# Altium schematic sheet TIDA-01349_MCU_Supply_PWM_Temp.SchDoc: MCUInterface_PowerSupply_PWM_Temperature
size 431 x 279 mm; Date: Not shown in title block; ApprovedBy: Not shown in title block; CheckedBy: Not shown in title block; Author: Not shown in title block; CompanyName: Not shown in title block; Engineer: Not shown in title block; Organization: Not shown in title block; Address1: Not shown in title block; Address2: Not shown in title block; Address3: Not shown in title block; Address4: Not shown in title block; DocumentNumber: 1; Revision: Use project parameter SCH_Rev; SheetNumber: 2; SheetTotal: 4; PageSetup: Record=PageOptions|CenterHorizontal=True|CenterVertical=True|PrintScale=1.00|XCorrection=1.00|YCorrection=1.00|PrintKind=0|BorderSize=5000000|LeftOffset=0|BottomOffset=0|Orientation=2|PaperLength=1000|PaperWidth=1000|Scale=100|PaperSource=15|PrintQuality=600|MediaType=1|DitherType=10|PaperKind=Letter|PrintScaleMode=1; CurrentTime: Not shown in title block; CurrentDate: Not shown in title block; Time: Not shown in title block; DocumentFullPathAndName: Not shown in title block; DocumentName: Not shown in title block; ModifiedDate: Not shown in title block; ImagePath: Not shown in title block
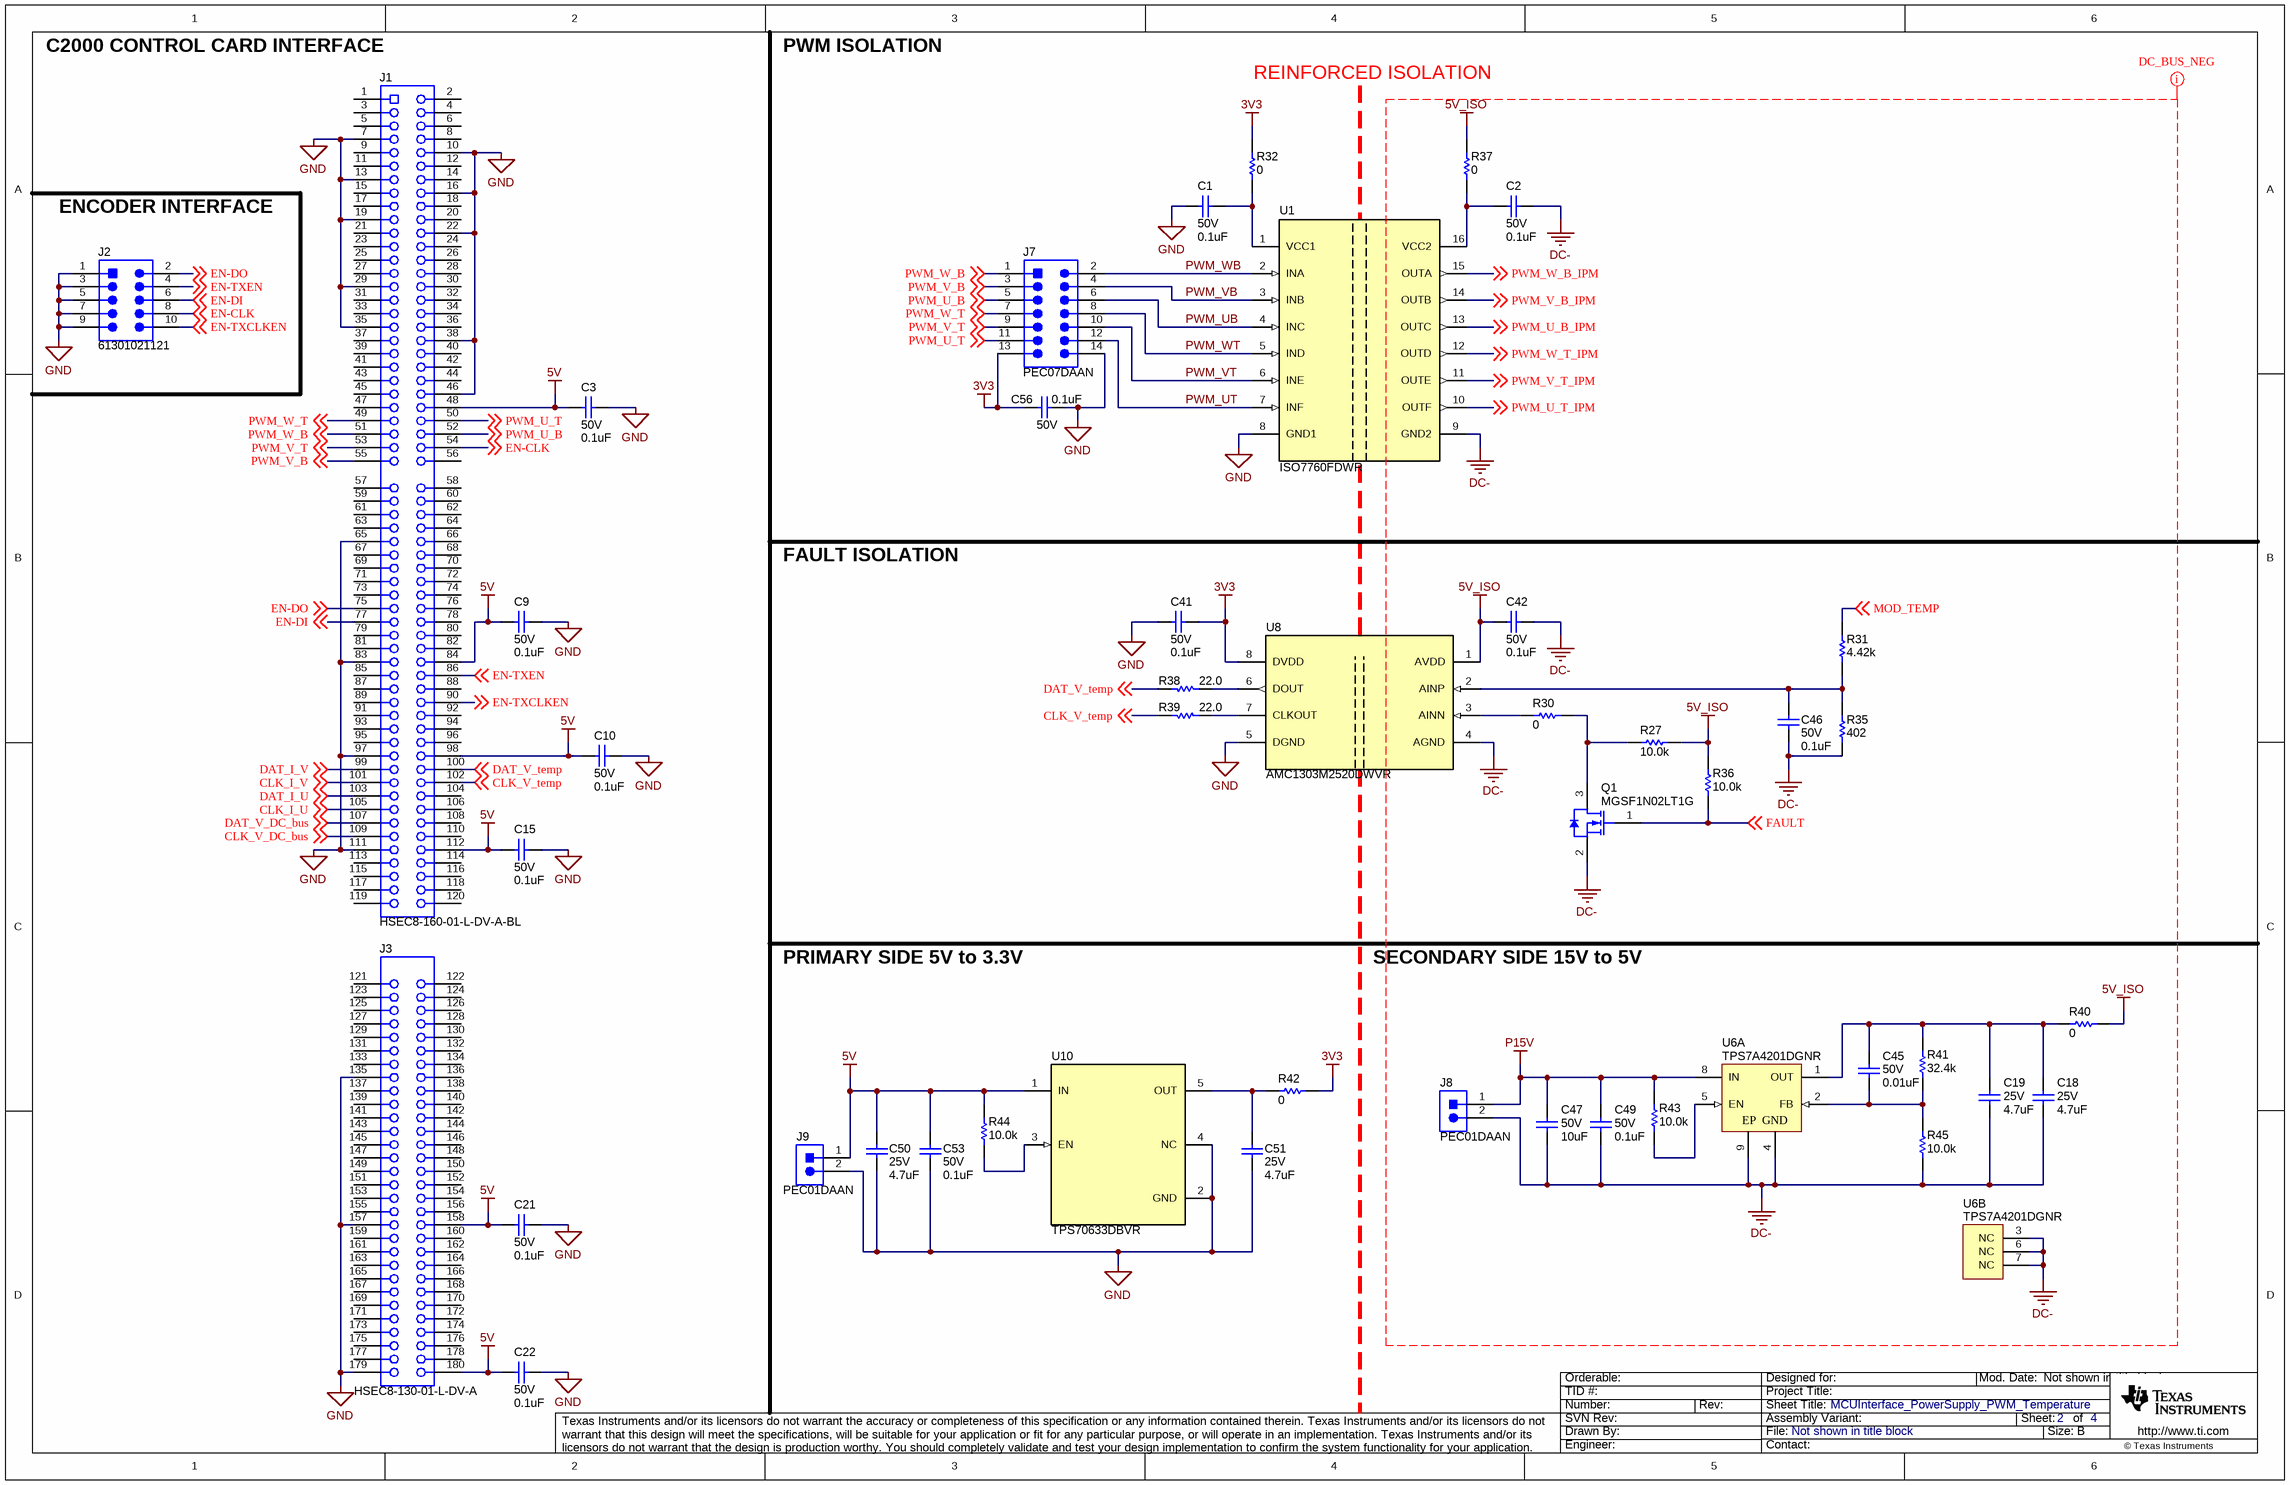
[diagram p0: TIDA-01349_MCU_Supply_PWM_Temp.SchDoc]

## Parts
(Parts that share a designator on the sheet are numbered #1, #2 ... from top to bottom, then left to right.)
C1  VDC_V: 50V  ValueDisplayed: 0.1uF  [0603]  (hidden comment: C0603C104K5RACTU)
C2  VDC_V: 50V  ValueDisplayed: 0.1uF  [0603]  (hidden comment: C0603C104K5RACTU)
C3  VDC_V: 50V  ValueDisplayed: 0.1uF  [0603]  (hidden comment: C0603C104K5RACTU)
C9  VDC_V: 50V  ValueDisplayed: 0.1uF  [0603]  (hidden comment: C0603C104K5RACTU)
C10  VDC_V: 50V  ValueDisplayed: 0.1uF  [0603]  (hidden comment: C0603C104K5RACTU)
C15  VDC_V: 50V  ValueDisplayed: 0.1uF  [0603]  (hidden comment: C0603C104K5RACTU)
C18  VDC_V: 25V  ValueDisplayed: 4.7uF  [0805_HV]  (hidden comment: C2012X7R1E475K125AB)
C19  VDC_V: 25V  ValueDisplayed: 4.7uF  [0805_HV]  (hidden comment: C2012X7R1E475K125AB)
C21  VDC_V: 50V  ValueDisplayed: 0.1uF  [0603]  (hidden comment: C0603C104K5RACTU)
C22  VDC_V: 50V  ValueDisplayed: 0.1uF  [0603]  (hidden comment: C0603C104K5RACTU)
C41  VDC_V: 50V  ValueDisplayed: 0.1uF  [0603]  (hidden comment: C0603C104K5RACTU)
C42  VDC_V: 50V  ValueDisplayed: 0.1uF  [0603]  (hidden comment: C0603C104K5RACTU)
C45  VDC_V: 50V  ValueDisplayed: 0.01uF  [0603]  (hidden comment: GRM188R71H103KA01D)
C46  VDC_V: 50V  ValueDisplayed: 0.1uF  [0603]  (hidden comment: C0603C104K5RACTU)
C47  VDC_V: 50V  ValueDisplayed: 10uF  [1210_280]  (hidden comment: C3225X7R1H106M250AC)
C49  VDC_V: 50V  ValueDisplayed: 0.1uF  [0603]  (hidden comment: C0603C104K5RACTU)
C50  VDC_V: 25V  ValueDisplayed: 4.7uF  [0805_HV]  (hidden comment: C2012X7R1E475K125AB)
C51  VDC_V: 25V  ValueDisplayed: 4.7uF  [0805_HV]  (hidden comment: C2012X7R1E475K125AB)
C53  VDC_V: 50V  ValueDisplayed: 0.1uF  [0603]  (hidden comment: C0603C104K5RACTU)
C56  VDC_V: 50V  ValueDisplayed: 0.1uF  [0603]  (hidden comment: C0603C104K5RACTU)
J1  HSEC8-160-01-L-DV-A-BL  [controlCARD-120HSEC]
J2  61301021121  [WURTH_61301021121]
J3  HSEC8-130-01-L-DV-A  [controlCARD-180HSEC-60pinAddon]
J7  PEC07DAAN  [CONN_PEC07DAAN]
J8  PEC01DAAN  [Sullins_PxC01DAAN]
J9  PEC01DAAN  [Sullins_PxC01DAAN]
Q1  MGSF1N02LT1G  [SOT-23]
R27  ValueDisplayed: 10.0k  [0603]  (hidden comment: CRCW060310K0FKEA)
R30  ValueDisplayed: 0  [0603]  (hidden comment: CRCW06030000Z0EA)
R31  ValueDisplayed: 4.42k  [0603]  (hidden comment: RC0603FR-074K42L)
R32  ValueDisplayed: 0  [0603]  (hidden comment: CRCW06030000Z0EA)
R35  ValueDisplayed: 402  [0603]  (hidden comment: CRCW0603402RFKEA)
R36  ValueDisplayed: 10.0k  [0603]  (hidden comment: CRCW060310K0FKEA)
R37  ValueDisplayed: 0  [0603]  (hidden comment: CRCW06030000Z0EA)
R38  ValueDisplayed: 22.0  [0603]  (hidden comment: RC0603FR-0722RL)
R39  ValueDisplayed: 22.0  [0603]  (hidden comment: RC0603FR-0722RL)
R40  ValueDisplayed: 0  [0603]  (hidden comment: CRCW06030000Z0EA)
R41  ValueDisplayed: 32.4k  [0603]  (hidden comment: RC0603FR-0732K4L)
R42  ValueDisplayed: 0  [0603]  (hidden comment: CRCW06030000Z0EA)
R43  ValueDisplayed: 10.0k  [0603]  (hidden comment: CRCW060310K0FKEA)
R44  ValueDisplayed: 10.0k  [0603]  (hidden comment: CRCW060310K0FKEA)
R45  ValueDisplayed: 10.0k  [0603]  (hidden comment: CRCW060310K0FKEA)
U1  ISO7760FDWR  [DW0016B_HV]
U6#1  TPS7A4201DGNR  [DGN0008B_N]  (part A of 2)
U6#2  TPS7A4201DGNR  [DGN0008B_N]  (part B of 2)
U8  AMC1303M2520DWVR  [DWV0008A]
U10  TPS70633DBVR  [DBV0005A_N]

## Nets
3V3: C41.1 C56.2 J7.13 R32.2 R42.2 U8.8(DVDD)
5V: C3.1 C9.1 C10.1 C15.1 C21.1 C22.1 C50.1 C53.1 J1.48 J1.84 J1.98 J1.112 J3.158 J3.180 J9.1 R44.2 U10.1(IN)
5V_ISO: C42.1 R27.1 R36.2 R37.2 R40.2 U8.1(AVDD)
DC-: C2.2 C18.2 C19.2 C42.2 C46.2 C47.2 C49.2 J8.2 Q1.2(S) R35.1 R45.1 U1.9(GND2) U6#1.4(GND) U6#1.9(EP) U6#2.3(NC) U6#2.6(NC) U6#2.7(NC) U8.4(AGND)
GND: C1.2 C3.2 C9.2 C10.2 C15.2 C21.2 C22.2 C41.2 C50.2 C51.2 C53.2 C56.1 J1.7 J1.10 J1.13 J1.16 J1.19 J1.22 J1.29 J1.35 J1.38 J1.46 J1.65 J1.83 J1.97 J1.111 J2.1 J2.3 J2.5 J2.7 J2.9 J3.135 J3.157 J3.179 J7.14 J9.2 U1.8(GND1) U8.5(DGND) U10.2(GND) U10.4(NC)
P15V: C47.1 C49.1 J8.1 R43.2 U6#1.8(IN)
CLK_I_U: J1.105 ; off-sheet CLK_I_U
CLK_I_V: J1.101 ; off-sheet CLK_I_V
CLK_V_DC_bus: J1.109 ; off-sheet CLK_V_DC_bus
CLK_V_temp: J1.102 R39.2 ; off-sheet CLK_V_temp
DAT_I_U: J1.103 ; off-sheet DAT_I_U
DAT_I_V: J1.99 ; off-sheet DAT_I_V
DAT_V_DC_bus: J1.107 ; off-sheet DAT_V_DC_bus
DAT_V_temp: J1.100 R38.2 ; off-sheet DAT_V_temp
EN-CLK: J1.54 J2.8 ; off-sheet EN-CLK
EN-DI: J1.77 J2.6 ; off-sheet EN-DI
EN-DO: J1.75 J2.2 ; off-sheet EN-DO
EN-TXCLKEN: J1.90 J2.10 ; off-sheet EN-TXCLKEN
EN-TXEN: J1.86 J2.4 ; off-sheet EN-TXEN
FAULT: Q1.1(G) R36.1 ; off-sheet FAULT
MOD_TEMP: R31.2 ; off-sheet MOD_TEMP
PWM_U_B: J1.52 J7.5 ; off-sheet PWM_U_B
PWM_U_B_IPM: U1.13(OUTC) ; off-sheet PWM_U_B_IPM
PWM_U_T: J1.50 J7.11 ; off-sheet PWM_U_T
PWM_U_T_IPM: U1.10(OUTF) ; off-sheet PWM_U_T_IPM
PWM_UB: J7.6 U1.4(INC)
PWM_UT: J7.12 U1.7(INF)
PWM_V_B: J1.55 J7.3 ; off-sheet PWM_V_B
PWM_V_B_IPM: U1.14(OUTB) ; off-sheet PWM_V_B_IPM
PWM_V_T: J1.53 J7.9 ; off-sheet PWM_V_T
PWM_V_T_IPM: U1.11(OUTE) ; off-sheet PWM_V_T_IPM
PWM_VB: J7.4 U1.3(INB)
PWM_VT: J7.10 U1.6(INE)
PWM_W_B: J1.51 J7.1 ; off-sheet PWM_W_B
PWM_W_B_IPM: U1.15(OUTA) ; off-sheet PWM_W_B_IPM
PWM_W_T: J1.49 J7.7 ; off-sheet PWM_W_T
PWM_W_T_IPM: U1.12(OUTD) ; off-sheet PWM_W_T_IPM
PWM_WB: J7.2 U1.2(INA)
PWM_WT: J7.8 U1.5(IND)
NetC1_1: C1.1 R32.1 U1.1(VCC1)
NetC2_1: C2.1 R37.1 U1.16(VCC2)
NetC18_1: C18.1 C19.1 C45.1 R40.1 R41.2 U6#1.1(OUT)
NetC45_2: C45.2 R41.1 R45.2 U6#1.2(FB)
NetC46_1: C46.1 R31.1 R35.2 U8.2(AINP)
NetC51_1: C51.1 R42.1 U10.5(OUT)
NetQ1_3: Q1.3(D) R27.2 R30.2
NetR30_1: R30.1 U8.3(AINN)
NetR38_1: R38.1 U8.6(DOUT)
NetR39_1: R39.1 U8.7(CLKOUT)
NetR43_1: R43.1 U6#1.5(EN)
NetR44_1: R44.1 U10.3(EN)

Not connected (* = marked no-connect by the designer): J1 1 2 3 4 5 6 8 9 11 12 14 15 17 18 20 21 23 24 25 26 27 28 30 31 32 33 34 36 37 39 40 41 42 43 44 45 47 56 57 58 59 60 61 62 63 64 66 67 68 69 70 71 72 73 74 76 78 79 80 81 82 85 87 88 89 91 92 93 94 95 96 104 106 108 110 113 114 115 116 117 118 119 120; J3 121 122 123 124 125 126 127 128 129 130 131 132 133 134 136 137 138 139 140 141 142 143 144 145 146 147 148 149 150 151 152 153 154 155 156 159 160 161 162 163 164 165 166 167 168 169 170 171 172 173 174 175 176 177 178

## Layout directives
net class DC_BUS_NEG: 5V_ISO, DC-, FAULT, MOD_TEMP, P15V, PWM_U_B_IPM, PWM_U_T_IPM, PWM_V_B_IPM, PWM_V_T_IPM, PWM_W_B_IPM, PWM_W_T_IPM

## Notes on the sheet
- C2000 CONTROL CARD INTERFACE
- PWM ISOLATION
- REINFORCED ISOLATION
- ENCODER INTERFACE
- FAULT ISOLATION
- PRIMARY SIDE 5V to 3.3V
- SECONDARY SIDE 15V to 5V
- Drawn By:
- SVN Rev:
- Number:
- TID #:
- Orderable:
- Rev:
- Sheet Title:
- File:
- Project Title:
- Designed for:
- Assembly Variant:
- Mod. Date:
- Sheet:
- Size:
- of
- B
- http://www.ti.com
- Texas Instruments and/or its licensors do not warrant the accuracy or completeness of this specification or any information contained therein. Texas Instruments and/or its licensors do not warrant that this design will meet the specifications, will be suitable for your application or fit for any particular purpose, or will operate in an implementation. Texas Instruments and/or its licensors do not warrant that the design is production worthy. You should completely validate and test your design implementation to confirm the system functionality for your application.
- Engineer:
- Contact:
- © Texas Instruments

## Library data of the parts
C1-C3 C9 C10 C15 C21 C22 C41 C42 C46 C53 C56 = CMP-0006861-2: CAP, CERM, 0.1 uF, 50 V, +/- 10%, X7R, 0603; Manufacturer: Kemet; TaMin_C: -55°C; Polarized: N; SizeAreaWB_mm2: 4.68; Value1: Unknown; U/M: EA; Value: 0.1uF; TaMax_C: 125°C; SizeZ_mm: 1; SizeX_mm: 1.6; SizeY_mm: 0.8; SizeArea_mm2: 1.28; Cap_F: 100nF; AEC Category: Q200; Supplier Part Number 2: 80-C0603C104K5R; Publisher: Texas Instruments; Supplier 2: Mouser; Supplier Part Number 3: 1288255; TempCo: X7R; Supplier 3: Farnell; Published: 2008-06-19; RoHS: Y; MountType: SMT; Supplier 1: Digi-Key; PackageReference: 0603; Tolerance_%: 10%; Cap_Case: 0603; Value2: 50V; CompType: Capacitor; LatestRevisionDate: 2017-03-09; PartNumber: C0603C104K5RACTU; AEC Qualified: ?; ComponentLink1Description: Datasheet link; Supplier Part Number 1: 399-5089-1-ND; Technology: Ceramic; ComponentLink1URL: http://www.kemet.com/kemet/web/homepage/kechome.nsf/vapubfiles/F3102_Y5V.pdf/$file/F3102_Y5V.pdf
C18 C19 C50 C51 = CMP-0007870-2: CAP, CERM, 4.7 uF, 25 V, +/- 10%, X7R, 0805; Manufacturer: TDK; TaMin_C: -55°C; Polarized: N; SizeAreaWB_mm2: 6.75; Value1: Unknown; U/M: EA; Value: 4.7uF; TaMax_C: 125°C; SizeZ_mm: 1.45; SizeX_mm: 2; SizeY_mm: 1.25; Cap_Case: 0805; SizeArea_mm2: 2.5; Cap_F: 4.7µF; AEC Category: Q200; Supplier Part Number 2: 04X3287; Publisher: Texas Instruments; Supplier 2: Newark; Supplier Part Number 3: 810-C2012X7R1E475K; TempCo: X7R; Supplier 3: Mouser; Published: 2008-06-19; RoHS: Y; MountType: SMT; Supplier 1: Digi-Key; PackageReference: 0805; Tolerance_%: 10%; Value2: 25V; CompType: Capacitor; LatestRevisionDate: 2017-03-09; PartNumber: C2012X7R1E475K125AB; AEC Qualified: N; ComponentLink1Description: Datasheet link; AEC Grade: N/A; Supplier Part Number 1: 445-5972-1-ND; Technology: Ceramic; ComponentLink1URL: https://product.tdk.com/info/en/catalog/datasheets/mlcc_commercial_general_en.pdf
C45 = CMP-0007433-4: CAP, CERM, 0.01 uF, 50 V, +/- 10%, X7R, 0603; Manufacturer: MuRata; TaMin_C: -55°C; Polarized: N; SizeAreaWB_mm2: 4.68; Value1: Unknown; U/M: EA; Value: 0.01uF; TaMax_C: 125°C; SizeZ_mm: 1; SizeX_mm: 1.6; SizeY_mm: 0.8; SizeArea_mm2: 1.28; Cap_F: 10nF; AEC Category: Q200; Supplier Part Number 2: 81-GRM39X103K50D; Publisher: Texas Instruments; Supplier 2: Mouser; Supplier Part Number 3: 8819980; TempCo: X7R; Supplier 3: Farnell; Published: 2008-06-19; RoHS: Y; MountType: SMT; Supplier 1: Digi-Key; PackageReference: 0603; Tolerance_%: 10%; Cap_Case: 0603; Value2: 50V; CompType: Capacitor; LatestRevisionDate: 2017-03-09; PartNumber: GRM188R71H103KA01D; AEC Qualified: ?; ComponentLink1Description: Datasheet link; Supplier Part Number 1: 490-1512-1-ND; Technology: Ceramic; ComponentLink1URL: http://search.murata.co.jp/Ceramy/PnsearchViewAction.do?HnOFG=ON&HnNFG=ON&SEL_CNT=50&sLang=en&sKey=GRM188R71H103KA01D&x=9&y=9&search=startwith
C47 = CMP-0009120-1: CAP, CERM, 10 uF, 50 V, +/- 20%, X7R, 1210; Manufacturer: TDK; TaMin_C: -55°C; Polarized: N; SizeAreaWB_mm2: 14.7; Value1: Unknown; U/M: EA; Value: 10uF; TaMax_C: 125°C; SizeZ_mm: 2.8; SizeX_mm: 3.2; SizeY_mm: 2.5; Cap_Case: 1210; SizeArea_mm2: 8; CompType: Capacitor; Cap_F: 10µF; AEC Category: Q200; ComponentLink1URL: http://product.tdk.com/en/catalog/datasheets/mlcc_commercial_general_en.pdf; Supplier Part Number 2: 29X4867; Publisher: Texas Instruments; Supplier 2: Newark; Supplier Part Number 3: 810-C3225X7R1H106MAC; TempCo: X7R; Supplier 3: Mouser; Published: 2008-06-19; RoHS: Y; MountType: SMT; Supplier 1: Digi-Key; PackageReference: 1210; Tolerance_%: 20%; Value2: 50V; LatestRevisionDate: 2017-03-09; PartNumber: C3225X7R1H106M250AC; AEC Qualified: ?; ComponentLink1Description: Datasheet link; Supplier Part Number 1: 445-14933-1-ND; Technology: Ceramic
C49 = CMP-0006861-2: CAP, CERM, 0.1 uF, 50 V, +/- 10%, X7R, 0603; Manufacturer: Kemet; TaMin_C: -55°C; Polarized: N; SizeAreaWB_mm2: 4.68; Value1: Unknown; U/M: EA; Value: 0.1uF; TaMax_C: 125°C; SizeZ_mm: 1; SizeX_mm: 1.6; SizeY_mm: 0.8; SizeArea_mm2: 1.28; CompType: Capacitor; Cap_F: 100nF; AEC Category: Q200; Supplier Part Number 2: 80-C0603C104K5R; Publisher: Texas Instruments; Supplier 2: Mouser; Supplier Part Number 3: 1288255; TempCo: X7R; Supplier 3: Farnell; Published: 2008-06-19; RoHS: Y; MountType: SMT; Supplier 1: Digi-Key; PackageReference: 0603; Tolerance_%: 10%; Cap_Case: 0603; Value2: 50V; LatestRevisionDate: 2017-03-09; PartNumber: C0603C104K5RACTU; AEC Qualified: ?; ComponentLink1Description: Datasheet link; Supplier Part Number 1: 399-5089-1-ND; Technology: Ceramic; ComponentLink1URL: http://www.kemet.com/kemet/web/homepage/kechome.nsf/vapubfiles/F3102_Y5V.pdf/$file/F3102_Y5V.pdf
J1 = CMP-0003814-1: C2000 controlCARD-120HSEC connector, SMT; Manufacturer: Samtec; Note: The pin numbering does not match Samtec datasheet; ComponentLink1URL: http://www.samtec.com/ftppub/pdf/hsec8_dv.pdf; Key: controlCARD-120HSEC; Publisher: Texas Instruments; CompType: Connector; PackageReference: C2000 pin numbering; LatestRevisionDate: 2017-03-09; RoHS: Y; MountType: SMT; PartNumber: HSEC8-160-01-L-DV-A-BL; ComponentLink1Description: Datasheet Link
J2 = CMP-0054806-1: Header, 2.54 mm, 5x2, Gold, TH; Manufacturer: Wurth Elektronik; CNHeader: TRUE; Green_Lifecycle: Active; Green_REACh: Passed; CT: FALSE; ComponentLink1URL: http://katalog.we-online.de/em/datasheet/6130xx21121.pdf; ClassName: Header; Supplier Part Number 2: 16T0631; Publisher: Texas Instruments; Supplier 2: Newark; Supplier Part Number 3: 710-61301021121; Supplier 3: Mouser; RoHS: Y; MountType: TH; Green_EU RoHS-2: Incomplete; Supplier 1: Digi-Key; Green_EU RoHS: Passed; PackageReference: Header, 2.54mm, 5x2, TH; CompType: Header; LatestRevisionDate: 26/05/2017; PartNumber: 61301021121; ComponentLink1Description: Datasheet URL; Supplier Part Number 1: 732-2672-ND
J3 = CMP-0003859-1: C2000 controlCARD-180HSEC (60-pin addon) connector, SMT; Manufacturer: Samtec; Note: The pin numbering does not match Samtec datasheet; ComponentLink1URL: http://suddendocs.samtec.com/prints/hsec8-1xxx-xx-xx-dv-x-xx-mkt.pdf; Key: controlCARD-180HSEC-60pinAddon; Publisher: Texas Instruments; CompType: Connector; PackageReference: C2000 pin numbering; LatestRevisionDate: 2017-03-09; RoHS: Y; MountType: SMT; PartNumber: HSEC8-130-01-L-DV-A; ComponentLink1Description: Datasheet Link
J7 = CMP-0002339-1: Header, 100mil, 7x2, Tin, TH; Manufacturer: Sullins Connector Solutions; CNHeader: TRUE; Current_A: 3A; Green_Lifecycle: Active; Shrouded: N; Gender: Male; Green_REACh: Passed; Voltage_V: 1.8kV; Row_Count: 2; RowSpacing_mm: 2.54; CT: FALSE; Cert_UL: Y; ComponentLink1URL: http://www.sullinscorp.com/catalogs/77_PAGE108-109_.100_MALE_HDR.pdf; ClassName: Header; Publisher: Texas Instruments; Color: Black; RoHS: Y; MountType: TH; Green_EU RoHS-2: Passed; Supplier 1: Digi-Key; Green_EU RoHS: Passed; PackageReference: Header, 7x2, 100mil, Tin; PinCount: 14; CompType: Header; LatestRevisionDate: 26/05/2017; PartNumber: PEC07DAAN; Orientation: Vertical; ComponentLink1Description: Datasheet URL; Supplier Part Number 1: S2012E-07-ND; Pitch_mm: 2.54; ContactFinish: Tin
J8 J9 = CMP-0054594-1: Header, 2.54mm, 1x2, Tin, Black, TH; Manufacturer: Sullins Connector Solutions; CNHeader: TRUE; Current_A: 3A; Green_Lifecycle: Active; Shrouded: N; Gender: Male; Green_REACh: Passed; Voltage_V: 1.8kV; Row_Count: 2; RowSpacing_mm: 2.54; CT: FALSE; Cert_UL: Y; ComponentLink1URL: http://www.sullinscorp.com/catalogs/77_PAGE108-109_.100_MALE_HDR.pdf; ClassName: Header; Publisher: Texas Instruments; Color: Black; RoHS: Y; MountType: TH; Green_EU RoHS-2: Passed; Supplier 1: Digi-Key; Green_EU RoHS: Passed; PackageReference: Header, 2.54mm, 2x1, TH; PinCount: 2; CompType: Header; LatestRevisionDate: 26/05/2017; PartNumber: PEC01DAAN; Orientation: Vertical; ComponentLink1Description: Datasheet URL; Supplier Part Number 1: S2012E-01-ND; Pitch_mm: 2.54; ContactFinish: Tin
Q1 = CMP-0000221-1: MOSFET, N-CH, 20 V, 0.75 A, SOT-23; Alternate Manufacturer: None; Manufacturer: ON Semiconductor; SizeZ_mm: 1.1; ChType: N; Value2: 6 nC; Value1: 0.1; VdsMax_V: 20V; SizeX_mm: 2.5; SizeY_mm: 3; Value: 20V; Rdson45_ohm: 1.3d; SizeArea_mm2: 7.5; AEC Category: Q101; IdsMax_A: 7.5dA; SizeAreaWB_mm2: 14; U/M: EA; QgTyp_nC: 6; Supplier 2: Newark; Supplier 3: Mouser; Supplier 1: Digi-Key; Supplier Part Number 1: MGSF1N02LT1GOSCT-ND; Supplier Part Number 2: 85W3162; PartNumber: MGSF1N02LT1G; ComponentLink1Description: Datasheet link; LatestRevisionDate: 2017-03-09; ComponentLink1URL: http://www.onsemi.com/pub_link/Collateral/MGSF1N02LT1-D.PDF; Vgs_V: 20V; CompType: MOSFET; PackageReference: SOT-23; LatestRevisionNote: Added parts.; Publisher: Texas Instruments; AEC Qualified: ?; Published: 2008-06-19; Supplier Part Number 3: 863-MGSF1N02LT1G; RoHS: Y; MountType: SMT
R27 R36 R43-R45 = CMP-0021998-2: RES, 10.0 k, 1%, 0.1 W, 0603; Manufacturer: Vishay-Dale; Power_W: 100mW; TempCo: 100 ppm/C; Value_Code: 10k0; U/M: EA; Value: 10.0k; EIA_Code: E96; Res_ohm: 10k; SizeX_mm: 1.6; SizeY_mm: 0.8; SizeZ_mm: 1; Value2: 0.1W; SizeArea_mm2: 1.28; VDC_V: 75V; AEC Category: Q200; Supplier Part Number 2: 52K8062; Publisher: Texas Instruments; Supplier 2: Newark; Supplier Part Number 3: 71-CRCW0603-10K-E3; Supplier 3: Mouser; Published: 2008-06-26; RoHS: Y; Value1: 1%; MountType: SMT; Supplier 1: Digi-Key; PackageReference: 0603; Tolerance_%: 1%; CompType: Resistor; LatestRevisionDate: 2017-03-09; PartNumber: CRCW060310K0FKEA; AEC Qualified: ?; ComponentLink1Description: Datasheet link; Supplier Part Number 1: 541-10.0KHCT-ND; Technology: Thick Film; ComponentLink1URL: http://www.vishay.com/docs/20035/dcrcwe3.pdf
R30 R32 R37 R40 R42 = CMP-0025697-3: RES, 0, 5%, 0.1 W, 0603; Manufacturer: Vishay-Dale; Power_W: 100mW; TempCo: 200 ppm/C; Value_Code: 0000; U/M: EA; Value: 0; EIA_Code: E24; SizeX_mm: 1.6; SizeY_mm: 0.8; SizeZ_mm: 1; Value2: 0.1W; SizeArea_mm2: 1.28; VDC_V: 75V; AEC Category: Q200; Supplier Part Number 2: 52K8014; Publisher: Texas Instruments; Supplier 2: Newark; Supplier Part Number 3: 71-CRCW0603-0-E3; Supplier 3: Mouser; Published: 2008-06-26; RoHS: Y; Value1: 5%; MountType: SMT; Supplier 1: Digi-Key; PackageReference: 0603; Tolerance_%: 5%; Res_ohm: 0; CompType: Resistor; LatestRevisionDate: 2017-03-09; PartNumber: CRCW06030000Z0EA; AEC Qualified: ?; ComponentLink1Description: Datasheet link; Supplier Part Number 1: 541-0.0GCT-ND; Technology: Thick Film; ComponentLink1URL: http://www.vishay.com/docs/20035/dcrcwe3.pdf
R31 = CMP-0023149-3: RES, 4.42 k, 1%, 0.1 W, 0603; Manufacturer: Yageo America; Power_W: 100mW; TempCo: 200 ppm/C; Value_Code: 4k42; U/M: EA; Value: 4.42k; EIA_Code: E96; SizeX_mm: 1.6; SizeY_mm: 0.8; SizeZ_mm: 1; Value2: 0.1W; SizeArea_mm2: 1.28; VDC_V: 150V; AEC Category: Q200; Supplier Part Number 2: 603-RC0603FR-074K42L; Publisher: Texas Instruments; Supplier 2: Mouser; Supplier Part Number 3: 9238565; Supplier 3: Farnell; Published: 2008-06-26; RoHS: Y; Value1: 1%; MountType: SMT; Supplier 1: Digi-Key; PackageReference: 0603; Tolerance_%: 1%; Res_ohm: 4.42k; CompType: Resistor; LatestRevisionDate: 2017-03-09; PartNumber: RC0603FR-074K42L; AEC Qualified: ?; ComponentLink1Description: Datasheet link; Supplier Part Number 1: 311-4.42KHRCT-ND; Technology: Thick Film; ComponentLink1URL: http://www.yageo.com/pdf/Pu-RC0603_51_PbFree_L_2.pdf
R35 = CMP-0022409-4: RES, 402, 1%, 0.1 W, 0603; Manufacturer: Vishay-Dale; Power_W: 100mW; TempCo: 100 ppm/C; Value_Code: 402R; U/M: EA; Value: 402; EIA_Code: E96; SizeX_mm: 1.6; SizeY_mm: 0.8; SizeZ_mm: 1; Value2: 0.1W; SizeArea_mm2: 1.28; VDC_V: 75V; AEC Category: Q200; Supplier Part Number 2: 52K8512; Publisher: Texas Instruments; Supplier 2: Newark; Supplier Part Number 3: 71-CRCW0603-402-E3; Supplier 3: Mouser; Published: 2008-06-26; RoHS: Y; Value1: 1%; MountType: SMT; Supplier 1: Digi-Key; PackageReference: 0603; Tolerance_%: 1%; Res_ohm: 402; CompType: Resistor; LatestRevisionDate: 2017-03-09; PartNumber: CRCW0603402RFKEA; AEC Qualified: ?; ComponentLink1Description: Datasheet link; Supplier Part Number 1: 541-402HCT-ND; Technology: Thick Film; ComponentLink1URL: http://www.vishay.com/docs/20035/dcrcwe3.pdf
R38 R39 = CMP-0022928-1: RES, 22.0, 1%, 0.1 W, 0603; Manufacturer: Yageo America; Power_W: 100mW; TempCo: 200 ppm/C; Value_Code: 22R0; U/M: EA; Value: 22.0; Res_ohm: 22; SizeX_mm: 1.6; SizeY_mm: 0.8; SizeZ_mm: 1; Value2: 0.1W; SizeArea_mm2: 1.28; VDC_V: 150V; AEC Category: Q200; ComponentLink1URL: http://www.yageo.com/pdf/Pu-RC0603_51_PbFree_L_2.pdf; Supplier Part Number 2: 603-RC0603FR-0722RL; Publisher: Texas Instruments; Supplier 2: Mouser; Supplier Part Number 3: 9238280; Supplier 3: Farnell; Published: 2008-06-26; RoHS: Y; Value1: 1%; MountType: SMT; Supplier 1: Digi-Key; PackageReference: 0603; Tolerance_%: 1%; CompType: Resistor; LatestRevisionDate: 2017-03-09; PartNumber: RC0603FR-0722RL; AEC Qualified: ?; ComponentLink1Description: Datasheet link; Supplier Part Number 1: 311-22.0HRCT-ND; Technology: Thick Film
R41 = CMP-0023030-3: RES, 32.4 k, 1%, 0.1 W, 0603; Manufacturer: Yageo America; Power_W: 100mW; TempCo: 200 ppm/C; Value_Code: 32k4; U/M: EA; Value: 32.4k; EIA_Code: E96; SizeX_mm: 1.6; SizeY_mm: 0.8; SizeZ_mm: 1; Value2: 0.1W; SizeArea_mm2: 1.28; VDC_V: 150V; AEC Category: Q200; Supplier Part Number 2: 603-RC0603FR-0732K4L; Publisher: Texas Instruments; Supplier 2: Mouser; Published: 2008-06-26; RoHS: Y; Value1: 1%; MountType: SMT; Supplier 1: Digi-Key; PackageReference: 0603; Tolerance_%: 1%; Res_ohm: 32.4k; CompType: Resistor; LatestRevisionDate: 2017-03-09; PartNumber: RC0603FR-0732K4L; AEC Qualified: ?; ComponentLink1Description: Datasheet link; Supplier Part Number 1: 311-32.4KHRCT-ND; Technology: Thick Film; ComponentLink1URL: http://www.yageo.com/pdf/Pu-RC0603_51_PbFree_L_2.pdf
U1 = CMP-0078765-1: High Speed, Robust EMC Six-Channel Digital Isolators, DW0016B (SOIC-16); Alternate Manufacturer: Texas Instruments; SizeAreaWB_mm2: 152.52; SizeZ_mm: 2.65; SizeX_mm: 10.4; SizeY_mm: 10.3; SizeArea_mm2: 107.12; CompType: IC; AEC Qualified: N; AEC Category: Q200; ComponentLink1URL: http://www.ti.com/lit/ds/symlink/iso7760.pdf; Alternate PartNumber: ISO7760FDW; PackageDescription: SOIC-16; RoHS: Y; MountType: SMT; ComponentLink2URL: http://www.ti.com/product/iso7760; ComponentLink2Description: Product Folder; Manufacturer: Texas Instruments; PackageReference: DW0016B; PartNumber: ISO7760FDWR; ComponentLink1Description: Datasheet Link
U6#1 U6#2 = CMP-0035943-1: Single Output LDO, 50 mA, Adjustable 1.175 to 26 V Output, 7 to 28 V Input, 8-pin MSOP (DGN), -40 to 125 degC, Green (RoHS & no Sb/Br); Manufacturer: Texas Instruments; Vout Adj(Min)(V): 1.161; Accuracy(%): 1; Vin(Min)(V): 7; Vdo(Typ)(mV): 290; Vin(Max)(V): 28; Vout Adj(Max)(V): 26; Iout(Max)(A): 0.05; SubFamily: Single Channel LDO; Iq(Typ)(mA): 0.02; Code_JEDEC: MO-187; ComponentLink3URL: http://www.ti.com/litv/pdf/mpds046e; ComponentLink1URL: http://www.ti.com/; DatasheetVersion: SBVS184; Eco-Plan: Green (RoHS & no Sb/Br); ComponentLink3Description: Package Specification; ComponentLink1Description: Manufacturer URL; ComponentLink2Description: Datasheet; PackageVersion: 4073271/F; PackageDescription: 8-Pin Plastic Small Outline, Body 3 x 3 mm, Pitch 0.65 mm; Mounting Technology: Surface Mount; ComponentLink2URL: http://www.ti.com/general/docs/lit/getliterature.tsp?genericPartNumber=TPS7A4201&fileType=pdf; PartNumber: TPS7A4201DGNR; PackageReference: DGN0008B
U8 = CMP-0078168-2: Small Reinforced Isolated Modulator With +/-250mV Input, Internal Clock, and CMOS Interface, DWV0008A (SOIC-8); Alternate Manufacturer: Texas Instruments; SizeAreaWB_mm2: 105.975; SizeZ_mm: 2.8; SizeX_mm: 11.5; SizeY_mm: 5.85; SizeArea_mm2: 67.275; CompType: IC; AEC Qualified: N; AEC Category: Q200; ComponentLink1URL: http://www.ti.com/lit/ds/symlink/amc1303m2520.pdf; Alternate PartNumber: AMC1303M2520DWV; PackageDescription: SOIC-8; RoHS: Y; MountType: SMT; ComponentLink2URL: http://www.ti.com/product/amc1303m2520; ComponentLink2Description: Product Folder; Manufacturer: Texas Instruments; PackageReference: DWV0008A; PartNumber: AMC1303M2520DWVR; ComponentLink1Description: Datasheet Link
U10 = CMP-0073776-1: 150-mA, 6.5-V, 1-uA IQ Voltage Regulators with Enable, DBV0005A (SOT-23-5); Alternate PartNumber: TPS70633DBVT; Alternate Manufacturer: Texas Instruments; SizeAreaWB_mm2: 14.82; U/M: EA; SizeZ_mm: 1.45; SizeX_mm: 2.8; SizeY_mm: 2.9; SizeArea_mm2: 8.12; CompType: IC; ComponentLink1URL: http://www.ti.com/lit/ds/symlink/tps706.pdf; Publisher: Texas Instruments; PackageDescription: SOT-23-5; RoHS: Y; Footprint Path 6: C:\AltiumLibraries\Footprints\TI\.PcbLib; MountType: SMT; Manufacturer: Texas Instruments; PackageReference: DBV0005A; LatestRevisionDate: 2017-06-09; PartNumber: TPS70633DBVR; ComponentLink1Description: Datasheet Link